# Altium schematic sheet QUTMS-BrakeLight-S02.SchDoc: Red LED Array
size A3; DrawnBy: Joseph Richards; DocumentNumber: 3; Revision: 1; SheetNumber: 3; SheetTotal: 3
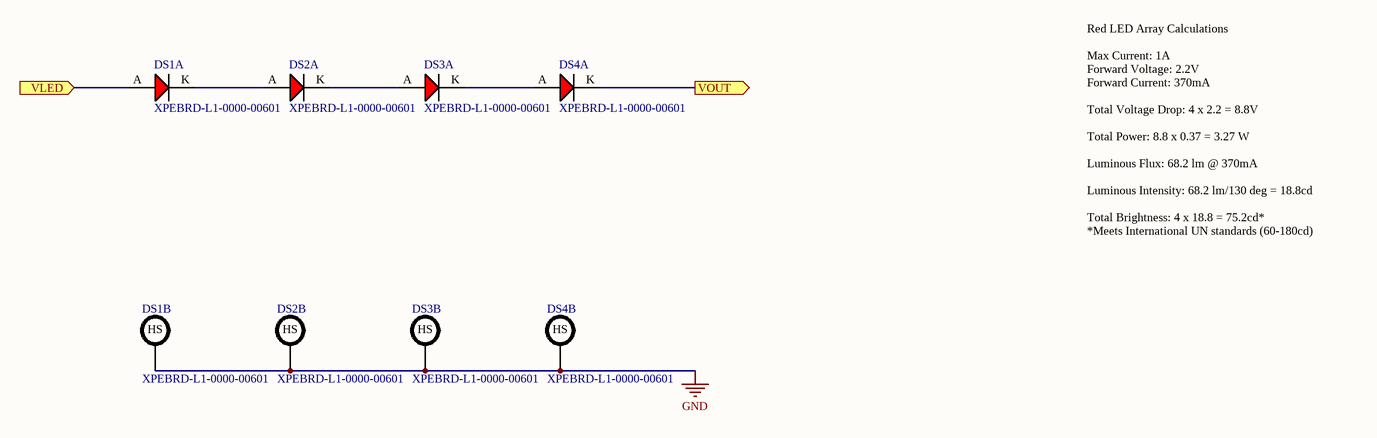
[diagram p0: QUTMS-BrakeLight-S02.SchDoc]

## Parts
DS1  XPEBRD-L1-0000-00601  [Cree XLamp XP-E2]  (parts A,B of 2)
DS2  XPEBRD-L1-0000-00601  [Cree XLamp XP-E2]  (parts A,B of 2)
DS3  XPEBRD-L1-0000-00601  [Cree XLamp XP-E2]  (parts A,B of 2)
DS4  XPEBRD-L1-0000-00601  [Cree XLamp XP-E2]  (parts A,B of 2)

## Ports
VLED (in), VOUT (out)

## Nets
GND: DS1.HS DS2.HS DS3.HS DS4.HS
VLED: DS1.A ; port VLED
VOUT: DS4.K ; port VOUT
NetDS1_K: DS1.K DS2.A
NetDS2_K: DS2.K DS3.A
NetDS3_K: DS3.K DS4.A

## Notes on the sheet
- Red LED Array Calculations
  Max Current: 1A
  Forward Voltage: 2.2V
  Forward Current: 370mA
  Total Voltage Drop: 4 x 2.2 = 8.8V
  Total Power: 8.8 x 0.37 = 3.27 W
  Luminous Flux: 68.2 lm @ 370mA
  Luminous Intensity: 68.2 lm/130 deg = 18.8cd
  Total Brightness: 4 x 18.8 = 75.2cd*
  *Meets International UN standards (60-180cd)
- Revision History:
- Sheet Title:
- Rev
- Date
- Description
- Project:
- Size:
- Drawn By:
- A3
- Number:
- Revision:
- Sheet
- Version:
- of
- QUT Motorsport
- O-120, Gardens Point
- 2 George Street
- Brisbane, QLD 4000
- Australia
- Print Date:
- Print Time:
- File Name:

## Library data of the parts
DS1-DS4 = XPEBRD-L1-0000-00601: LED, Cree XLamp XP-E2 Series, Red, 630 nm, 130 °, 62 lm, 1 A; ComponentLink1Description: Element14; ComponentLink1URL: https://au.element14.com/cree/xpebrd-l1-0000-00601/led-smd-xlamp-xpe-e-red-62lm/dp/2335107